# Altium schematic sheet D_OUTPUT.SchDoc
size A3; Date: *******; ApprovedBy: *******; CheckedBy: None; Author: *******; CompanyName: *******; DrawnBy: V.HIEU; Engineer: *******; Organization: *******; Address2: *******; Address3: *******; Address4: *******; DocumentNumber: Doc Num; Revision: V1.0; Email: truongvanhieu17102005@gmail.com; CurrentTime: *******; CurrentDate: *******; Time: *******; DocumentFullPathAndName: *******; DocumentName: *******; ModifiedDate: *******; ImagePath: *******; ProjectName: *******; Application_BuildNumber: *******
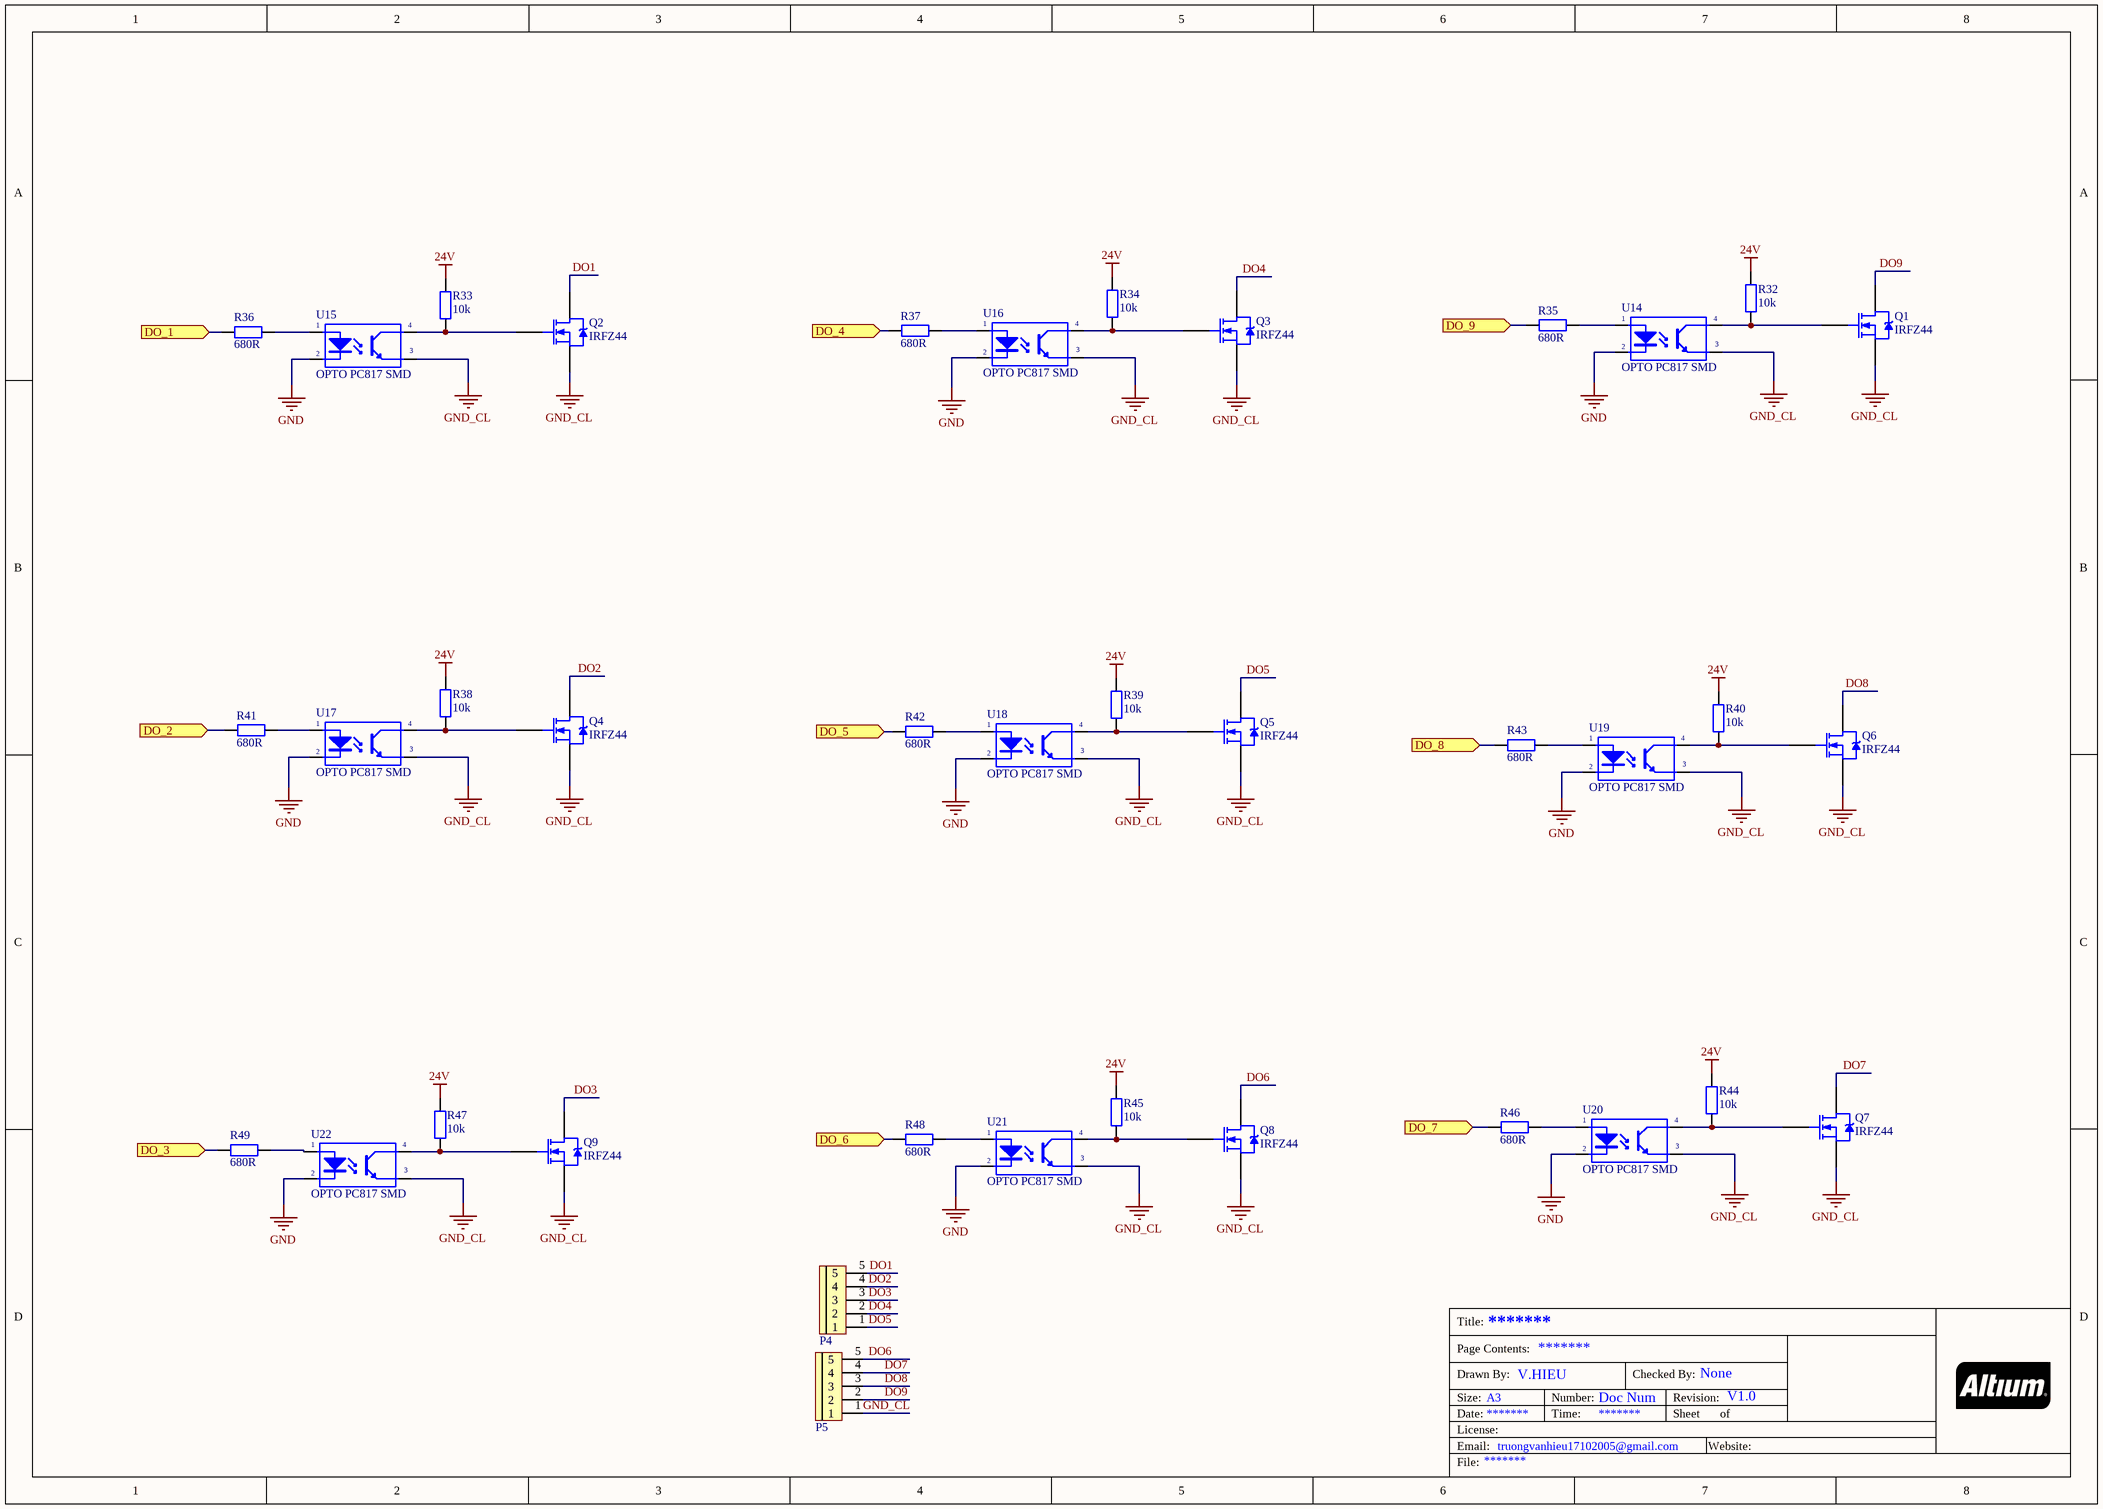
[diagram p0: D_OUTPUT.SchDoc]

## Parts
P4  CON 5 EDG5.08  [CON 5 5EDG5.08]  (value not drawn)
P5  CON 5 EDG5.08  [CON 5 5EDG5.08]  (value not drawn)
Q1  IRFZ44  [TO220]
Q2  IRFZ44  [TO220]
Q3  IRFZ44  [TO220]
Q4  IRFZ44  [TO220]
Q5  IRFZ44  [TO220]
Q6  IRFZ44  [TO220]
Q7  IRFZ44  [TO220]
Q8  IRFZ44  [TO220]
Q9  IRFZ44  [TO220]
R32  10k  [tro smd 0805]
R33  10k  [tro smd 0805]
R34  10k  [tro smd 0805]
R35  680R  [Tro SMD 0805]
R36  680R  [Tro SMD 0805]
R37  680R  [Tro SMD 0805]
R38  10k  [tro smd 0805]
R39  10k  [tro smd 0805]
R40  10k  [tro smd 0805]
R41  680R  [Tro SMD 0805]
R42  680R  [Tro SMD 0805]
R43  680R  [Tro SMD 0805]
R44  10k  [tro smd 0805]
R45  10k  [tro smd 0805]
R46  680R  [Tro SMD 0805]
R47  10k  [tro smd 0805]
R48  680R  [Tro SMD 0805]
R49  680R  [Tro SMD 0805]
U14  OPTO PC817 SMD  [SOP4]
U15  OPTO PC817 SMD  [SOP4]
U16  OPTO PC817 SMD  [SOP4]
U17  OPTO PC817 SMD  [SOP4]
U18  OPTO PC817 SMD  [SOP4]
U19  OPTO PC817 SMD  [SOP4]
U20  OPTO PC817 SMD  [SOP4]
U21  OPTO PC817 SMD  [SOP4]
U22  OPTO PC817 SMD  [SOP4]

## Ports
DO_1 (in), DO_2 (in), DO_3 (in), DO_4 (in), DO_5 (in), DO_6 (in), DO_7 (in), DO_8 (in), DO_9 (in)

## Nets
24V: R32.1 R33.1 R34.1 R38.1 R39.1 R40.1 R44.1 R45.1 R47.1
GND: U14.2(K) U15.2(K) U16.2(K) U17.2(K) U18.2(K) U19.2(K) U20.2(K) U21.2(K) U22.2(K)
GND_CL: P5.1 Q1.3(S) Q2.3(S) Q3.3(S) Q4.3(S) Q5.3(S) Q6.3(S) Q7.3(S) Q8.3(S) Q9.3(S) U14.3(E) U15.3(E) U16.3(E) U17.3(E) U18.3(E) U19.3(E) U20.3(E) U21.3(E) U22.3(E)
DO1: P4.5 Q2.2(D)
DO2: P4.4 Q4.2(D)
DO3: P4.3 Q9.2(D)
DO4: P4.2 Q3.2(D)
DO5: P4.1 Q5.2(D)
DO6: P5.5 Q8.2(D)
DO7: P5.4 Q7.2(D)
DO8: P5.3 Q6.2(D)
DO9: P5.2 Q1.2(D)
DO_1: R36.1 ; port DO_1
DO_2: R41.1 ; port DO_2
DO_3: R49.1 ; port DO_3
DO_4: R37.1 ; port DO_4
DO_5: R42.1 ; port DO_5
DO_6: R48.1 ; port DO_6
DO_7: R46.1 ; port DO_7
DO_8: R43.1 ; port DO_8
DO_9: R35.1 ; port DO_9
NetQ1_1: Q1.1(G) R32.2 U14.4(C)
NetQ2_1: Q2.1(G) R33.2 U15.4(C)
NetQ3_1: Q3.1(G) R34.2 U16.4(C)
NetQ4_1: Q4.1(G) R38.2 U17.4(C)
NetQ5_1: Q5.1(G) R39.2 U18.4(C)
NetQ6_1: Q6.1(G) R40.2 U19.4(C)
NetQ7_1: Q7.1(G) R44.2 U20.4(C)
NetQ8_1: Q8.1(G) R45.2 U21.4(C)
NetQ9_1: Q9.1(G) R47.2 U22.4(C)
NetR35_2: R35.2 U14.1(A)
NetR36_2: R36.2 U15.1(A)
NetR37_2: R37.2 U16.1(A)
NetR41_2: R41.2 U17.1(A)
NetR42_2: R42.2 U18.1(A)
NetR43_2: R43.2 U19.1(A)
NetR46_2: R46.2 U20.1(A)
NetR48_2: R48.2 U21.1(A)
NetR49_2: R49.2 U22.1(A)

## Notes on the sheet
- Title:
- Size:
- Drawn By:
- Page Contents:
- A3
- Number:
- Checked By:
- Revision:
- Date:
- File:
- License:
- Email:
- Time:
- Sheet
- Website:
- of

## Library data of the parts
P4 P5 = CON 5 EDG5.08: Cắm; Ten_Linh_Kien: CON 5 2EDG5.08-5P 5.08MM ( Xanh Cong); Ma_Hang: MH003589; Kieu_Chan: *; Don_Vi: Con; Ghi_Chu: *; Chung_Loai: Cắm
Q1-Q9 = FET IRFZ44 DIP: TO-220
R32-R34 R38-R40 R44 R45 R47 = Tro 0805 1% 10k: Dán; Don_Vi: Con; So_Chan: 2; Ten_Linh_Kien: Trở 0805 1% 10k; Ma_Hang: MH005473; Chung_Loai: Dán; Kieu_Chan: *
R35-R37 R41-R43 R46 R48 R49 = Tro 0805 5% 680R: Dán; Don_Vi: Con; Ma_Hang: MH005344; So_Chan: 2; Ten_Linh_Kien: Trở 0805 5% 680R; Chung_Loai: Dán; Kieu_Chan: *
U14-U22 = OPTO PC817 SMD: Single Opto; Value: PC817